# EAGLE design senpai (EAGLE 6.1)
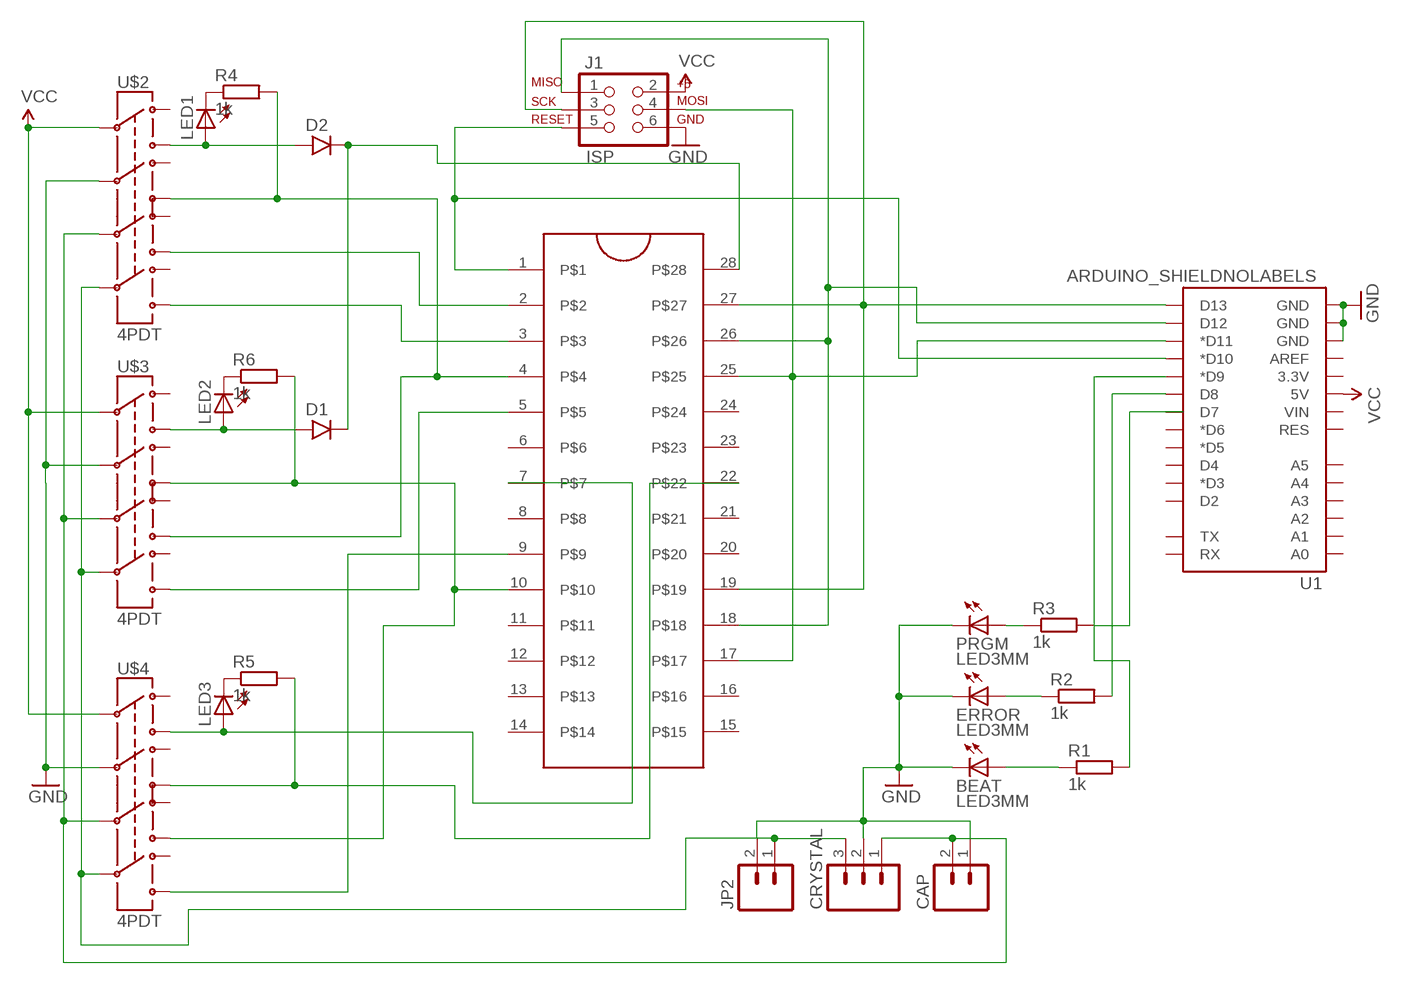
[diagram p0: schematic, sheet 1]

## Parts
BEAT  LED3MM  LED5MM  [LED5MM]
CAP  M02PTH  [1X02]
CRYSTAL  M03LOCK  [1X03_LOCK]
D1  DO41.2  [DO41-2]
D2  DO41.2  [DO41-2]
ERROR  LED3MM  LED5MM  [LED5MM]
J1  ISP  AVR_SPI_PRG_6PTH  [2X3]
JP2  M02PTH  [1X02]
LED1  LED5MM  [LED5MM]
LED2  LED5MM  [LED5MM]
LED3  LED5MM  [LED5MM]
PRGM  LED3MM  LED5MM  [LED5MM]
R1  1k  R-EU_0204/7  [0204/7]
R2  1k  R-EU_0204/7  [0204/7]
R3  1k  R-EU_0204/7  [0204/7]
R4  1k  R-EU_0204/7  [0204/7]
R5  1k  R-EU_0204/7  [0204/7]
R6  1k  R-EU_0204/7  [0204/7]
U1  ARDUINO_SHIELDNOLABELS  [DUEMILANOVE_SHIELD_NOLABELS]
U$1  ZIFSOCKET-28-3ZIFFSOCKET-28-3  [DIL28-3-ZIF_SOCKET]
U$2  4PDT  [4PDT]
U$3  4PDT  [4PDT]
U$4  4PDT  [4PDT]

## Nets
GND: BEAT.K(C) CAP.1 CRYSTAL.2 ERROR.K(C) J1.6 JP2.2 PRGM.K(C) U1.GND@0(GND) U1.GND@1(GND) U1.GND@2(GND) U$2.5 U$3.5 U$4.5
N$1: J1.4 U1.D11(*D11) U$1.17 U$1.25
N$2: J1.1 U1.D12 U$1.18 U$1.26
N$3: J1.3 U1.D13 U$1.19 U$1.27
N$4: J1.5 U1.D10(*D10) U$1.1
N$5: CAP.2 CRYSTAL.1 U$2.8 U$3.8 U$4.8
N$6: CRYSTAL.3 JP2.1 U$2.11 U$3.11 U$4.11
N$7: LED3.K(C) R5.1
N$8: R5.2 U$1.22 U$4.6
N$9: LED1.K(C) R4.1
N$10: BEAT.A R1.1
N$11: ERROR.A R2.1
N$12: PRGM.A R3.1
N$13: D1.A LED2.A U$3.3
N$14: D2.A LED1.A U$2.3
N$16: R4.2 U$1.4 U$2.6 U$3.9
N$17: R1.2 U1.D9(*D9)
N$18: R2.2 U1.D8
N$19: R3.2 U1.D7
N$20: U$1.2 U$2.9
N$21: U$1.3 U$2.12
N$22: R6.2 U$1.10 U$3.6 U$4.9
N$23: D1.C D2.C U$1.28
N$24: U$1.5 U$3.12
N$25: LED3.A U$1.7 U$4.3
N$26: U$1.9 U$4.12
N$27: LED2.K(C) R6.1
VCC: J1.2 U1.5V U$2.2 U$3.2 U$4.2
Unconnected: U1.3.3V U1.A0 U1.A1 U1.A2 U1.A3 U1.A4 U1.A5 U1.AREF U1.D2 U1.D3(*D3) U1.D4 U1.D5(*D5) U1.D6(*D6) U1.RES U1.RX U1.TX U1.VIN U$1.6 U$1.8 U$1.11 U$1.12 U$1.13 U$1.14 U$1.15 U$1.16 U$1.20 U$1.21 U$1.23 U$1.24 U$2.1 U$2.4 U$2.7 U$2.10 U$3.1 U$3.4 U$3.7 U$3.10 U$4.1 U$4.4 U$4.7 U$4.10

## Library data of the parts
BEAT ERROR LED1-LED3 PRGM = SparkFun:LED: LEDs Standard schematic elements and footprints for 5mm, 3mm, 1206, and 0603 sized LEDs. 5mm - Spark Fun Electronics SKU : COM-00529 (and others)
CAP JP2 = SparkFun:M02: Header 2 Standard 2-pin 0.1" header. Use with straight break away headers (SKU : PRT-00116), right angle break away headers (PRT-00553), swiss pins (PRT-00743), machine pins (PRT-00117), and female headers (PRT-00115). Molex polarized connector foot print use with SKU : PRT-08233 with associated crimp pins and housings.
CRYSTAL = SparkFun:M03: Header 3 Standard 3-pin 0.1" header. Use with straight break away headers (SKU : PRT-00116), right angle break away headers (PRT-00553), swiss pins (PRT-00743), machine pins (PRT-00117), and female headers (PRT-00115). Molex polarized connector foot print use with SKU : PRT-08232 with associated crimp pins and housings.
D1 D2 = gm-diodes:DO41: DO-41 Package Diodes: 1N4001 - 1N40019 Zener Diodes: 1N4728 - 1N4764
J1 = SparkFun:AVR_SPI_PRG_6: AVR ISP 6 Pin This is the reduced ISP connector for AVR programming. Common on Arduino. This footprint will take up less PCB space and can be used with a 10-pin to 6-pin adapter such as SKU: BOB-08508
R1-R6 = rcl:R-EU_: RESISTOR, European symbol
U1 = SparkFun:ARDUINO_SHIELD
U$1 = SparkFun:ZIFSOCKET-28-3
U$2-U$4 = 4PDT:4PDT

## Board
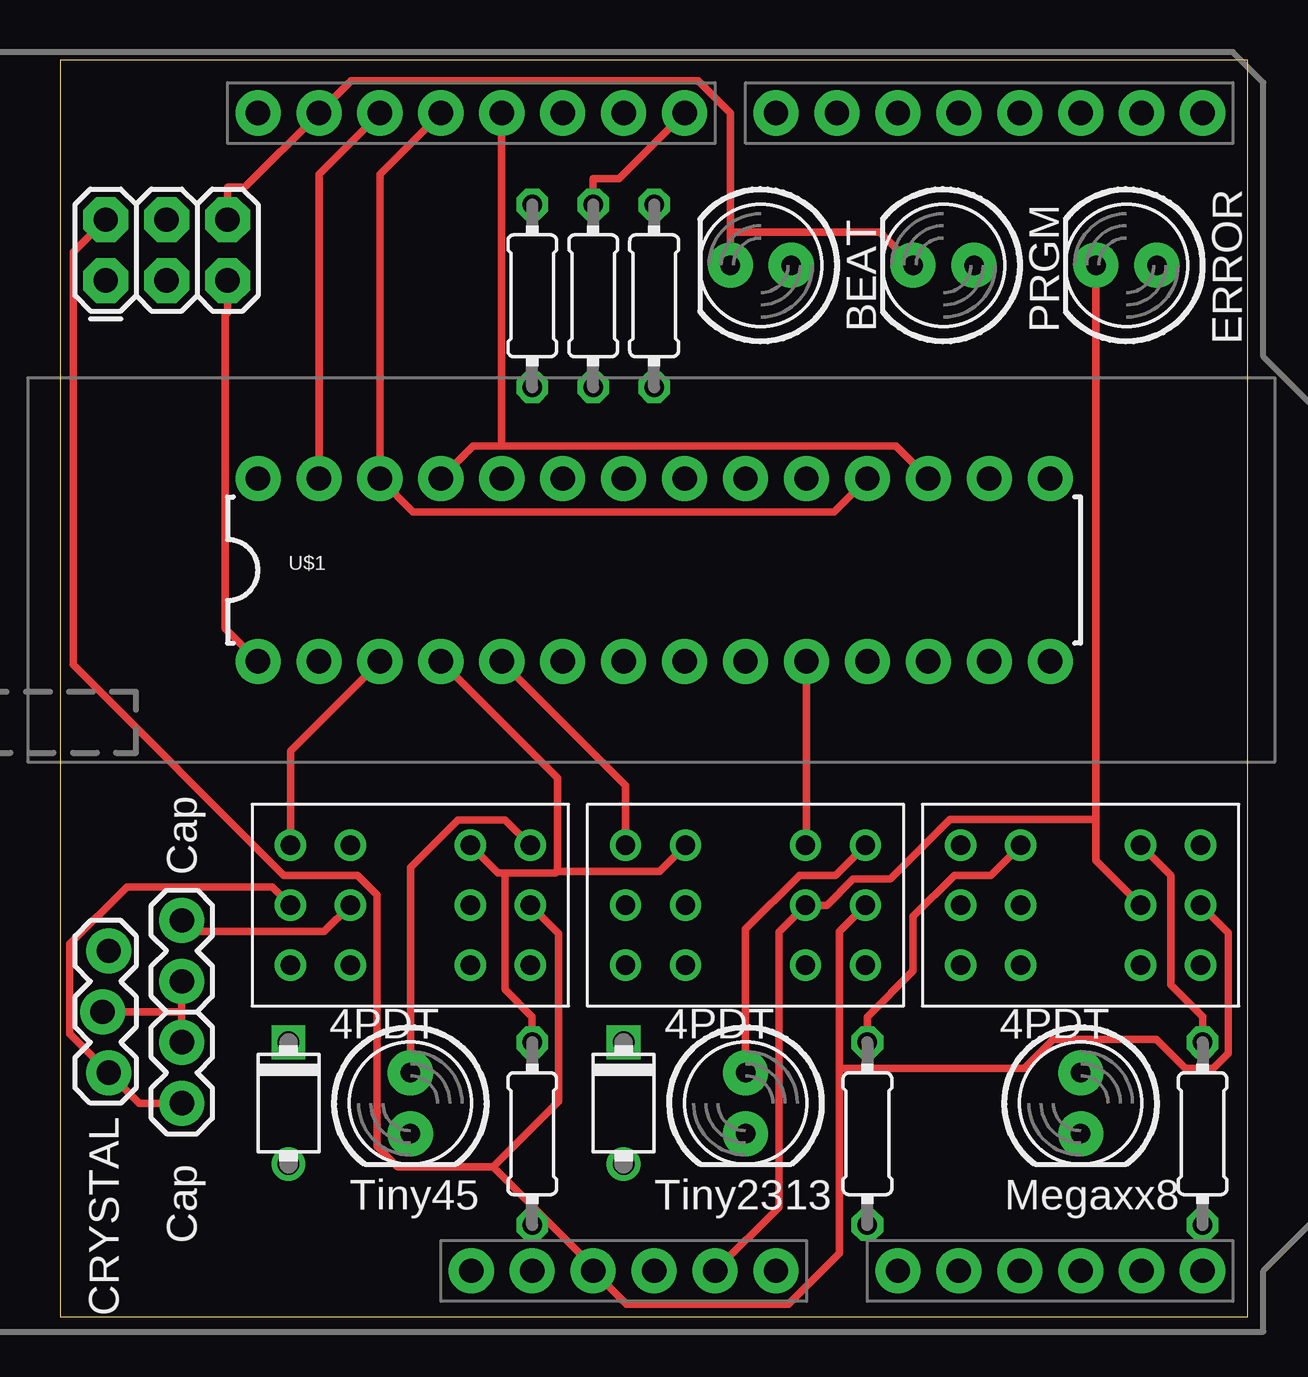
[diagram p1: board, top side]
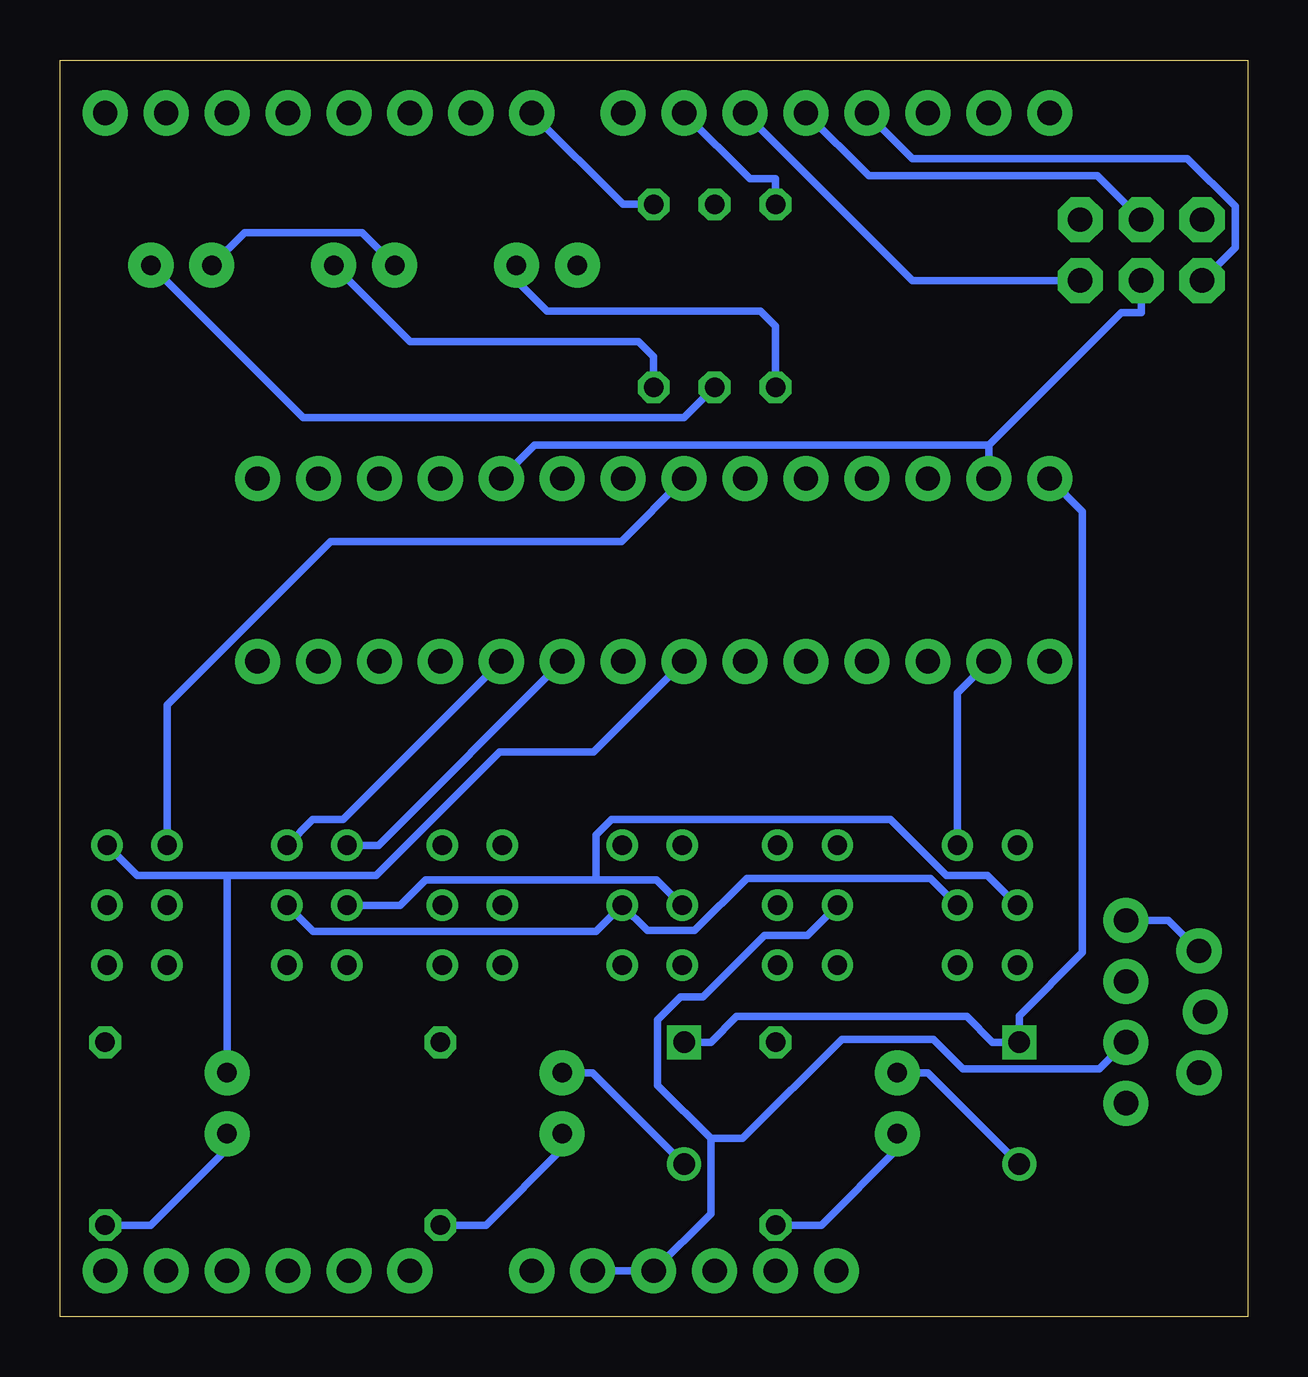
[diagram p2: board, bottom side, seen from below]

Size 49.51 x 52.38 mm. Coordinates in mm from the lower left corner, seen from the top.
Outline: 0,0 49.51,0 49.51,52.38 0,52.38 0,0
Copper layers (1*16): Top 0.035mm / dielectric 1.5mm / Bottom 0.035mm
Design rules: minimum track width 12mil, minimum drill 24mil, track to track 10mil, track to pad 10mil, pad to pad 10mil, via to via 10mil, smd to smd 8mil, copper to edge 40mil, drill to drill 8mil, minimum pad ring 10mil, minimum via ring 8mil, stop-mask expansion 4mil, vias tented up to drill 0mil, thermal gap 10mil

### Footprints (pad centres in the part's own frame; a part is rotated, then mirrored left to right if it is on the bottom)
LED5MM = drill 0.813 pad 1.88: A -1.27,0; K 1.27,0
1X02 = drill 1.016 pad 1.88: 1 0,0; 2 2.54,0
1X03_LOCK = drill 1.016 pad 1.88: 1 0,0.127; 2 2.54,-0.127; 3 5.08,0.127
DO41-2 = drill 0.9: A 2.54,0 | drill 0.9 square: C -2.54,0
2X3 = drill 1.016 pad 1.88 octagon: 1 0,0; 2 0,2.54; 3 2.54,0; 4 2.54,2.54; 5 5.08,0; 6 5.08,2.54
0204/7 = drill 0.813 octagon: 1 -3.81,0; 2 3.81,0
DUEMILANOVE_SHIELD_NOLABELS = drill 1.016 pad 1.88: 3.3V 50.8,26.67; 5V 50.8,29.21; A0 50.8,41.91; A1 50.8,44.45; A2 50.8,46.99; A3 50.8,49.53; A4 50.8,52.07; A5 50.8,54.61; AREF 2.54,15.24; D2 2.54,49.53; D3 2.54,46.99; D4 2.54,44.45; D5 2.54,41.91; D6 2.54,39.37; D7 2.54,36.83; D8 2.54,33.02; D9 2.54,30.48; D10 2.54,27.94; D11 2.54,25.4; D12 2.54,22.86; D13 2.54,20.32; GND@0 50.8,31.75; GND@1 50.8,34.29; GND@2 2.54,17.78; RES 50.8,24.13; RX 2.54,54.61; TX 2.54,52.07; VIN 50.8,36.83
DIL28-3-ZIF_SOCKET = drill 1.016 pad 1.88: 1 -16.51,-3.81; 2 -13.97,-3.81; 3 -11.43,-3.81; 4 -8.89,-3.81; 5 -6.35,-3.81; 6 -3.81,-3.81; 7 -1.27,-3.81; 8 1.27,-3.81; 9 3.81,-3.81; 10 6.35,-3.81; 11 8.89,-3.81; 12 11.43,-3.81; 13 13.97,-3.81; 14 16.51,-3.81; 15 16.51,3.81; 16 13.97,3.81; 17 11.43,3.81; 18 8.89,3.81; 19 6.35,3.81; 20 3.81,3.81; 21 1.27,3.81; 22 -1.27,3.81; 23 -3.81,3.81; 24 -6.35,3.81; 25 -8.89,3.81; 26 -11.43,3.81; 27 -13.97,3.81; 28 -16.51,3.81
4PDT = drill 0.8: 1 -5,2.5; 2 -5,0; 3 -5,-2.5; 4 -2.5,2.5; 5 -2.5,0; 6 -2.5,-2.5; 7 2.5,2.5; 8 2.5,0; 9 2.5,-2.5; 10 5,2.5; 11 5,0; 12 5,-2.5

### Placement (x,y rotation side)
BEAT  29.21,43.81 180 top
CAP  5.08,13.97 90 top
CRYSTAL  1.91,15.24 270 top
D1  23.5,8.89 270 top
D2  9.53,8.89 270 top
ERROR  44.45,43.81 180 top
J1  1.91,43.18 0 top
JP2  5.08,8.89 90 top
LED1  14.61,8.89 270 top
LED2  28.57,8.89 270 top
LED3  42.55,8.89 270 top
PRGM  36.83,43.81 180 top
R1  19.68,42.55 90 top
R2  22.23,42.55 90 top
R3  24.77,42.55 90 top
R4  19.68,7.62 90 top
R5  47.62,7.62 90 top
R6  33.66,7.62 90 top
U1  -6.99,52.7 270 top
U$1  24.77,31.11 0 top
U$2  14.61,17.14 180 top
U$3  28.57,17.14 180 top
U$4  42.55,17.14 180 top

### Tracks (layer width: path | path; a pad name or v marks a point on that pad's centre or on a via)
GND
  Top 0.305: 43.18,20.71 43.18,19.01 U$4.5 | 43.18,20.71 ERROR.K | 43.18,20.71 37.09,20.71 34.61,18.23 33.06,18.23 31.97,17.14 U$3.5 29.96,16.03 29.96,4.56 U1.GND@1 | 27.94,45.19 34.18,45.19 PRGM.K | 27.94,45.19 BEAT.K | 27.94,45.19 27.94,50.17 26.59,51.51 12.14,51.51 U1.GND@2 7.7,47.07 6.99,47.07 J1.6 | 5.08,12.7 CAP.1 | 5.08,12.7 JP2.2 | CRYSTAL.2 5.08,12.7
  Bottom 0.305: PRGM.K 36.92,45.18 41.81,45.18 ERROR.K | 22.38,7.42 21.06,7.42 16.92,11.56 13.1,11.56 11.87,10.32 6.19,10.32 JP2.2 | 22.38,7.42 24.61,9.64 24.61,12.36 23.64,13.33 22.72,13.33 20.15,15.89 18.36,15.89 U$2.5 | 22.38,7.42 22.38,4.29 U1.GND@0 U1.GND@1
N$1
  Top 0.305: 18.41,36.27 34.85,36.27 U$1.17 | U$1.25 17.22,36.27 18.41,36.27 | 18.41,36.27 U1.D11
  Bottom 0.305: U1.D11 15.8,47.55 6.27,47.55 J1.4
N$2
  Top 0.305: U$1.18 32.27,33.54 14.72,33.54 U$1.26 13.34,47.62 U1.D12
  Bottom 0.305: J1.1 0.53,44.56 0.53,46.28 2.51,48.27 13.97,48.27 U1.D12
N$3
  Top 0.305: U1.D13 10.79,47.62 U$1.27
  Bottom 0.305: 10.79,36.31 5.27,41.83 4.45,41.83 J1.3 | 10.79,36.31 29.73,36.31 U$1.19 | U$1.27 10.79,36.31
N$4
  Top 0.305: J1.5 6.99,41.83 6.88,41.73 6.88,28.68 U$1.1
  Bottom 0.305: J1.5 13.97,43.18 U1.D10
N$5
  Top 0.305: U$2.8 11.01,16.05 5.54,16.05 CAP.2
  Bottom 0.305: U$4.8 38.95,16.05 27.17,16.05 U$3.8 25.01,16.08 23.05,16.08 20.88,18.26 13.22,18.26 U$2.8 | CAP.2 3.3,16.51 CRYSTAL.1
N$6
  Top 0.305: U$2.11 8.84,17.91 2.8,17.91 0.42,15.53 0.42,11.78 CRYSTAL.3 3.3,8.89 JP2.1
  Bottom 0.305: 27.16,18.21 24.64,18.21 U$3.11 | U$4.11 35.33,17.14 34.27,18.21 27.16,18.21 | 27.16,18.21 27.16,20.08 26.52,20.72 14.89,20.72 12.56,18.39 10.86,18.39 U$2.11
N$7
  Bottom 0.305: LED3.K 42.55,6.99 45.72,3.81 R5.1
N$8
  Top 0.305: R5.2 47.62,12.5 46.3,13.83 46.3,18.39 U$4.6
  Bottom 0.305: U$4.6 45.05,25.5 38.23,32.31 26.11,32.31 U$1.22
N$9
  Bottom 0.305: LED1.K 14.61,6.99 17.78,3.81 R4.1
N$10
  Bottom 0.305: BEAT.A 30.48,43.18 29.21,41.91 20.32,41.91 19.68,41.27 R1.1
N$11
  Bottom 0.305: ERROR.A 39.37,37.47 23.5,37.47 R2.1
N$12
  Bottom 0.305: PRGM.A 34.92,40.64 25.4,40.64 24.77,40.01 R3.1
N$13
  Top 0.305: U$3.3 32.33,18.39 30.82,18.39 28.57,16.15 LED2.A
  Bottom 0.305: LED2.A 27.3,10.16 D1.A
N$14
  Top 0.305: U$2.3 18.54,20.71 16.59,20.71 14.61,18.72 LED1.A
  Bottom 0.305: LED1.A 13.34,10.16 D2.A
N$16
  Top 0.305: 20.73,18.56 20.73,22.45 U$1.4 | 18.54,18.49 20.66,18.49 20.73,18.56 | U$3.9 24.99,18.56 20.73,18.56 | 18.54,18.49 18.54,13.64 19.68,12.5 R4.2 | U$2.6 18.26,18.49 18.54,18.49
N$17
  Bottom 0.305: R1.2 19.68,47.42 20.75,47.42 U1.D9
N$18
  Top 0.305: R2.2 22.23,47.42 23.29,47.42 U1.D8
N$19
  Bottom 0.305: U1.D7 26.04,46.35 R3.2
N$20
  Bottom 0.305: U$2.9 12.11,26 U$1.2
N$21
  Top 0.305: U$2.12 9.61,23.57 U$1.3
N$22
  Top 0.305: R6.2 33.66,12.5 35.56,14.4 35.56,16.68 37.28,18.39 38.8,18.39 U$4.9 | U$3.6 31.11,19.68 U$1.10
  Bottom 0.305: U$1.10 37.71,20.71 38.98,20.71 U$4.9
N$23
  Bottom 0.305: U$1.28 6.89,33.56 6.89,15.18 9.53,12.54 D2.C 10.64,11.43 11.71,12.5 21.31,12.5 22.38,11.43 D1.C
N$24
  Top 0.305: U$3.12 23.57,22.14 U$1.5
N$25
  Bottom 0.305: 42.55,18.39 46.3,18.39 U$4.3 | U$1.7 27.27,23.53 31.19,23.53 36.33,18.39 42.55,18.39 | 42.55,18.39 LED3.A
N$26
  Bottom 0.305: U$4.12 36.23,19.64 U$1.9
N$27
  Bottom 0.305: LED2.K 28.57,6.99 31.75,3.81 R6.1
VCC
  Top 0.305: 32.48,10.35 40.19,10.35 41.4,11.55 45.7,11.55 46.91,10.35 48.08,10.35 48.7,10.97 48.7,15.99 U$4.2 | 32.48,10.35 32.48,2.63 30.36,0.51 23.62,0.51 U1.5V 22.23,2.06 18.05,6.24 | 32.48,10.35 32.48,16.05 U$3.2 | 18.05,6.24 14.08,6.24 13.22,7.1 13.22,17.57 12.4,18.39 9.32,18.39 0.55,27.17 0.55,44.36 J1.2 | U$2.2 20.78,15.97 20.78,8.98 18.05,6.24

### Text on the board
tPlace: Cap | Cap | Tiny45 | Tiny2313 | Megaxx8